# Altium schematic sheet 06_SOM_Console.SchDoc
size 420 x 297 mm; SheetNumber: 11; SheetTotal: 29
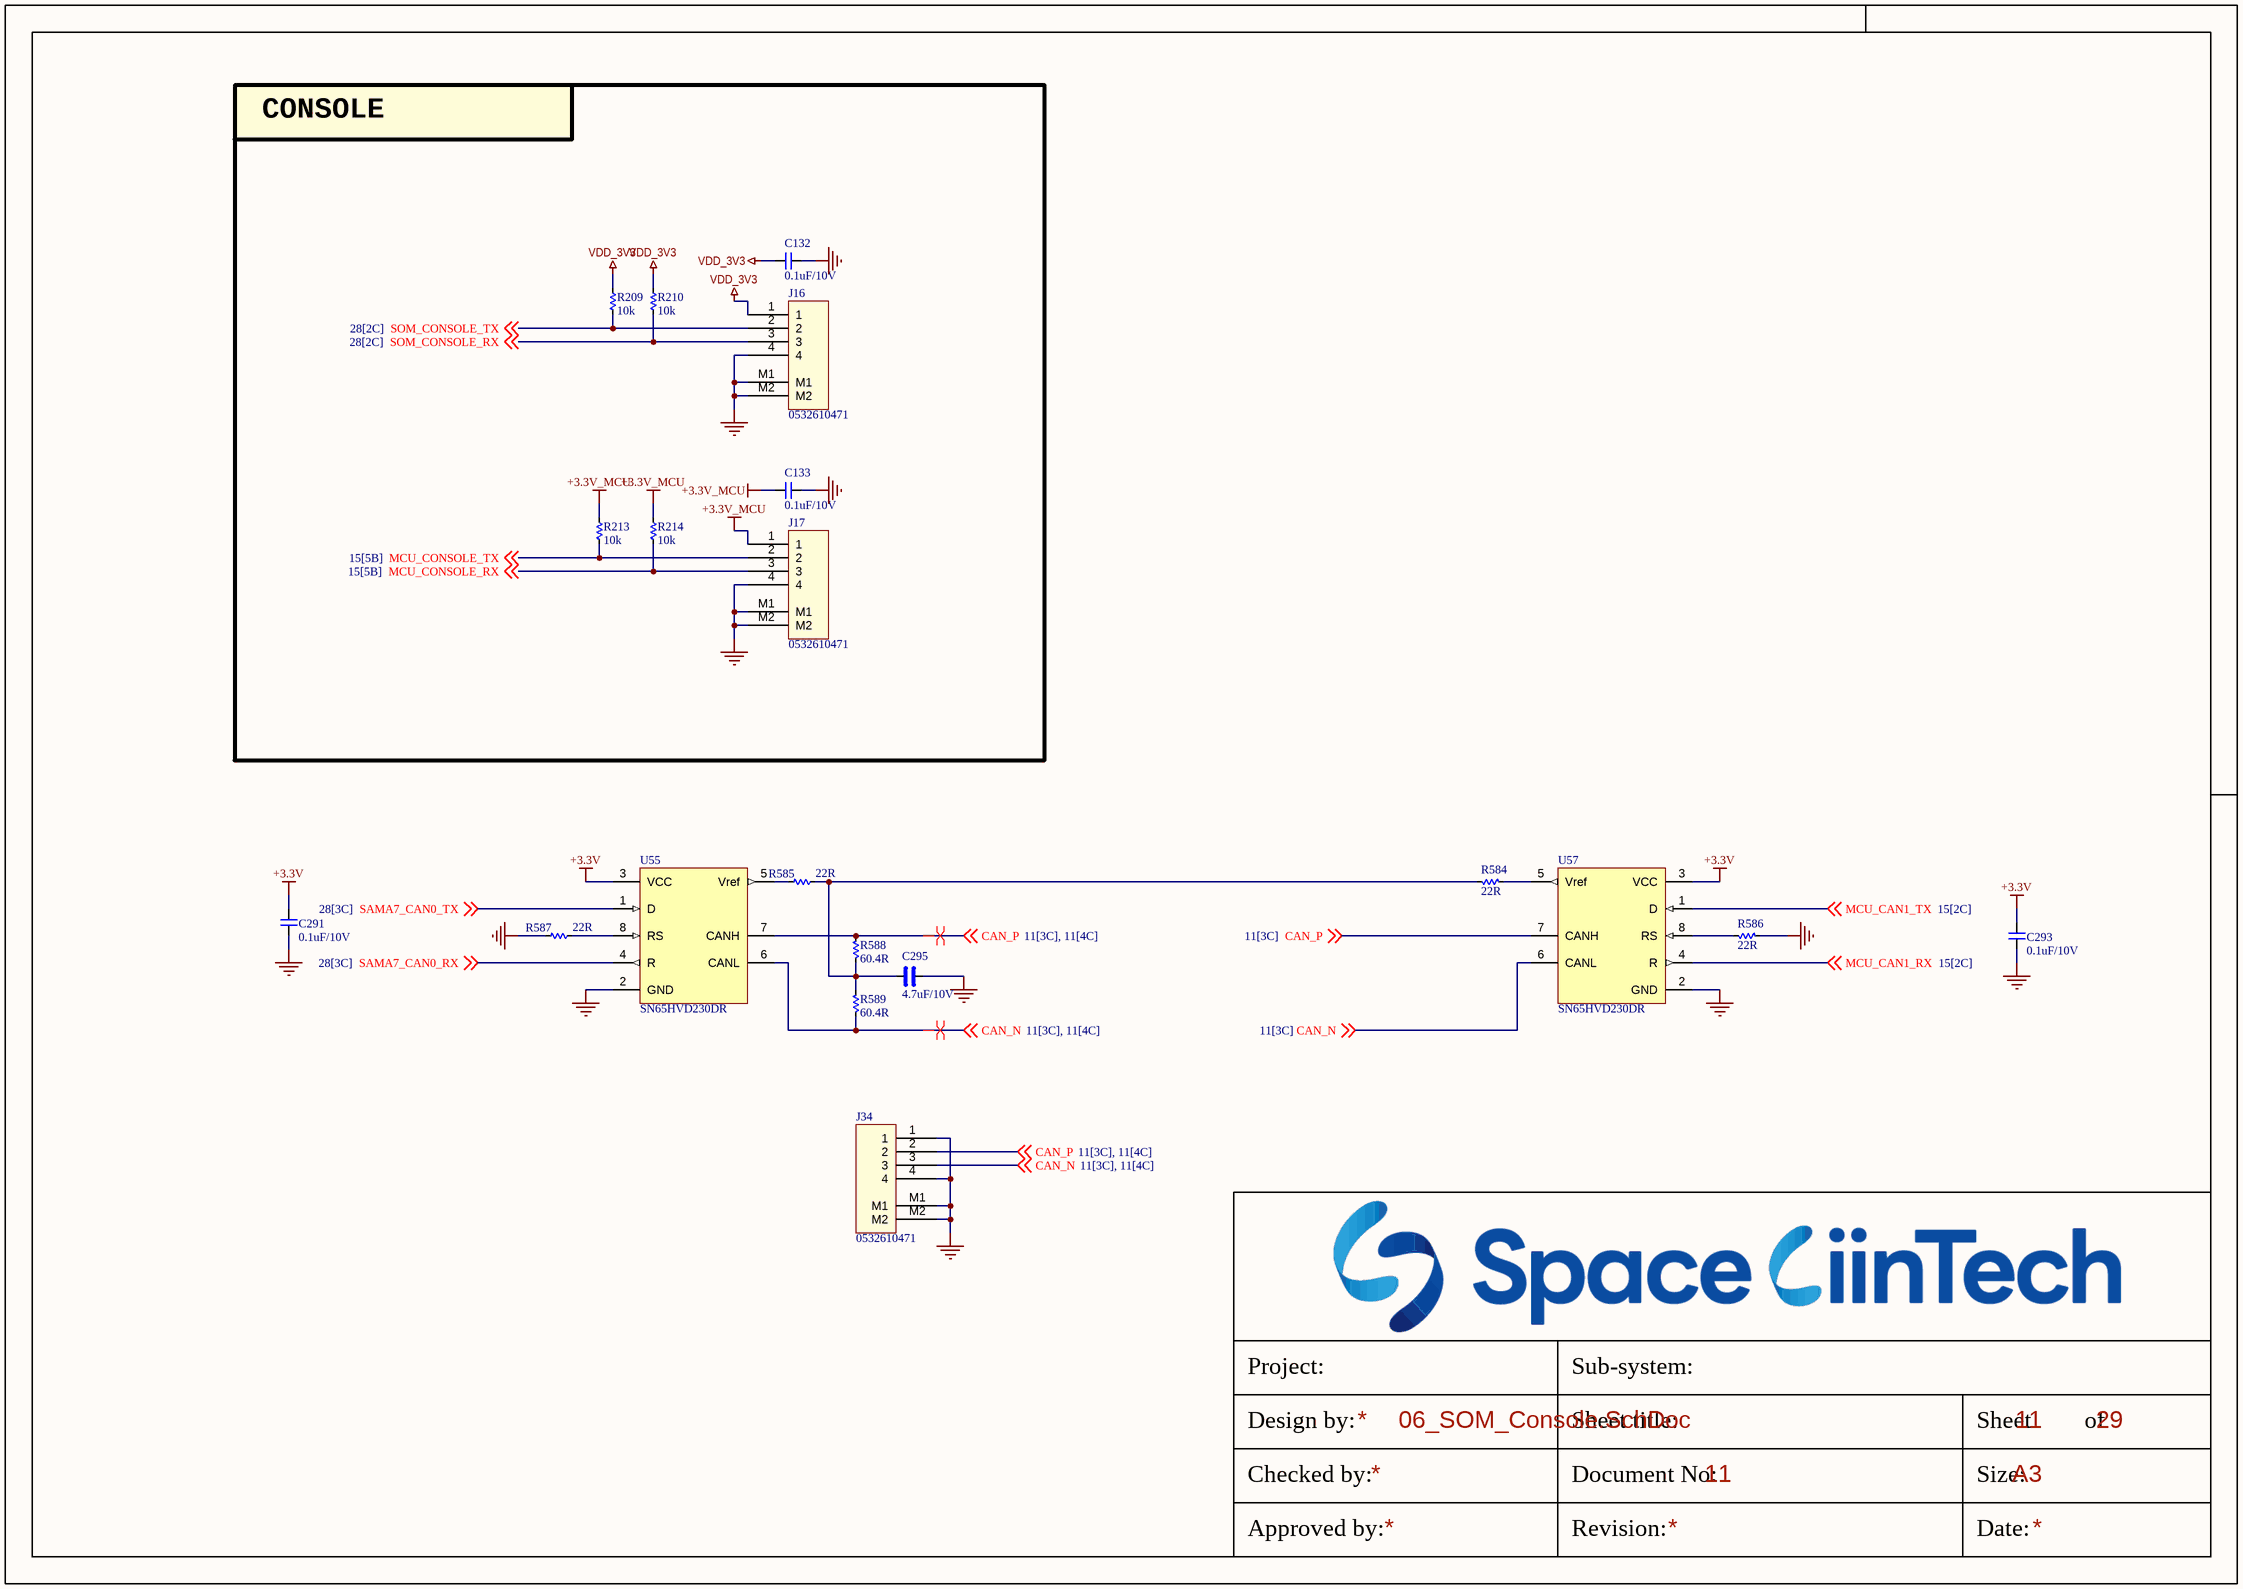
[diagram p0: 06_SOM_Console.SchDoc]

## Parts
C132  0.1uF/10V  [CAP_C_1005X60]
C133  0.1uF/10V  [CAP_C_1005X60]
C291  0.1uF/10V  [CAP_C_1005X60]
C293  0.1uF/10V  [CAP_C_1005X60]
C295  4.7uF/10V  [CAP_C_1005X60]
J16  0532610471  [MOLEX_0532610471]
J17  0532610471  [MOLEX_0532610471]
J34  0532610471  [MOLEX_0532610471]
R209  10k  [RES_C_1005X40]
R210  10k  [RES_C_1005X40]
R213  10k  [RES_C_1005X40]
R214  10k  [RES_C_1005X40]
R584  22R  [RES_C_1005X40]
R585  22R  [RES_C_1005X40]
R586  22R  [RES_C_1005X40]
R587  22R  [RES_C_1005X40]
R588  60.4R  [RES_C_1005X40]
R589  60.4R  [RES_C_1005X40]
U55  SN65HVD230DR  [SOIC127P602X173-8N]
U57  SN65HVD230DR  [SOIC127P602X173-8N]

## Blocks framed on the sheet
CONSOLE: C132 C133 J16 J17 R209 R210 R213 R214

## Nets
+3.3V: C291.2 C293.2 U55.3(VCC) U57.3(VCC)
+3.3V_MCU: C133.2 J17.1 R213.2 R214.2
GND: C132.1 C133.1 C291.1 C293.1 C295.1 J16.4 J16.M1 J16.M2 J17.4 J17.M1 J17.M2 J34.1 J34.4 J34.M1 J34.M2 R586.2 R587.2 U55.2(GND) U57.2(GND)
VDD_3V3: C132.2 J16.1 R209.2 R210.2
CAN_N: J34.3 R589.1 U55.6(CANL) U57.6(CANL) ; off-sheet CAN_N
CAN_P: J34.2 R588.2 U55.7(CANH) U57.7(CANH) ; off-sheet CAN_P
MCU_CAN1_RX: U57.4(R) ; off-sheet MCU_CAN1_RX
MCU_CAN1_TX: U57.1(D) ; off-sheet MCU_CAN1_TX
MCU_CONSOLE_RX: J17.3 R214.1 ; off-sheet MCU_CONSOLE_RX
MCU_CONSOLE_TX: J17.2 R213.1 ; off-sheet MCU_CONSOLE_TX
SAMA7_CAN0_RX: U55.4(R) ; off-sheet SAMA7_CAN0_RX
SAMA7_CAN0_TX: U55.1(D) ; off-sheet SAMA7_CAN0_TX
SOM_CONSOLE_RX: J16.3 R210.1 ; off-sheet SOM_CONSOLE_RX
SOM_CONSOLE_TX: J16.2 R209.1 ; off-sheet SOM_CONSOLE_TX
NetC295_2: C295.2 R584.1 R585.1 R588.1 R589.2
NetR584_2: R584.2 U57.5(Vref)
NetR585_2: R585.2 U55.5(Vref)
NetR586_1: R586.1 U57.8(RS)
NetR587_1: R587.1 U55.8(RS)

## Layout directives
differential pair; differential pair class DIFF: CAN_N, CAN_P

## Notes on the sheet
- Project:
- Sub-system:
- Design by:
- Sheet title:
- Sheet
- of
- Checked by:
- Approved by:
- Revision:
- Document No:
- Size:
- Date:
- A3

## Library data of the parts
C132 C133 C291 C293 = _CAP_C_2: CAP CHIP
C295 = _CAP_C_High_2: CAP CHIP High Value
J16 J17 J34 = Header 4x1_2M
R209 R210 R213 R214 R584-R589 = _RES_B_2: RES
U55 U57 = IC_CAN_SN65HVD230DR: IC TRANSCEIVER HALF 1/1 8SOIC